# Altium schematic sheet PowerSupply.SchDoc
size A4; SheetNumber: 2; SheetTotal: 6
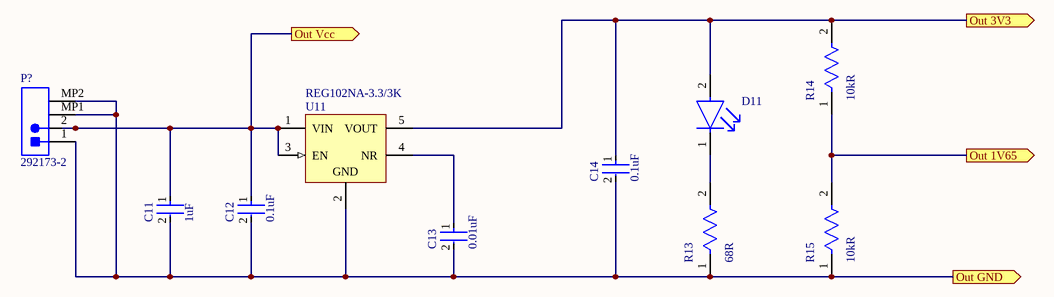
[diagram p0: PowerSupply.SchDoc]

## Parts
C11  Capacitance: 1uF  [FP-0603-L_1_6_0_15-W_0_81-IPC_A]  (hidden comment: 0603ZD105KAT2A)
C12  Capacitance: 0.1uF  [FP-0603-L_1_6_0_15-W_0_81-IPC_A]  (hidden comment: 0603ZD105KAT2A)
C13  Capacitance: 0.01uF  [FP-0603-L_1_6_0_15-W_0_81-IPC_A]  (hidden comment: 0603ZD105KAT2A)
C14  Capacitance: 0.1uF  [FP-0603-L_1_6_0_15-W_0_81-IPC_A]  (hidden comment: 0603ZD105KAT2A)
D11  TLMP1100-GS08  [FP-6_541-5056_01-4-MFG]  (value not drawn)
P?  292173-2  [TECO-292173-2_V]
R13  Resistance: 68R  [FP-CRCW0603-e3-IPC_B]  (hidden comment: CRCW060311K5FKEA)
R14  Resistance: 10kR  [FP-CRCW0603-e3-IPC_B]  (hidden comment: CRCW060311K5FKEA)
R15  Resistance: 10kR  [FP-CRCW0603-e3-IPC_B]  (hidden comment: CRCW060311K5FKEA)
U11  REG102NA-3.3/3K  [DBV0005A_N]

## Ports
Out 1V65 (out), Out 3V3 (out), Out GND (out), Out Vcc (out)

## Nets
Out 1V65: R14.1 R15.2 ; port Out 1V65
Out 3V3: C14.1 D11.2(A) R14.2 U11.5(VOUT) ; port Out 3V3
Out GND: C11.2 C12.2 C13.2 C14.2 P?.1 P?.MP1 P?.MP2 R13.1 R15.1 U11.2(GND) ; port Out GND
Out Vcc: C11.1 C12.1 P?.2 U11.1(VIN) U11.3(EN) ; port Out Vcc
NetC13_1: C13.1 U11.4(NR)
NetD11_1: D11.1(C) R13.2

## Library data of the parts
C11-C14 = CMP-2006-04559-3: General Purpose Ceramic Capacitor, 0603, 1uF, 10%, X5R, 15%, 10V; Insulation Resistance: 100GR; Dissipation Factor: 5%; Packaging: Tape and Reel; RoHS Compliant: Yes; Height: 0.9mm; Tolerance: 10%; Length: 1.6mm; Depth: 0.81mm; Case/Package: 0603; Max Operating Temperature: 85°C; Series: -; Dielectric: X5R; Construction: Flat; REACH SVHC: No SVHC; Voltage Rating: 10V; Number of Pins: 2; Radiation Hardening: No; Case Code (Imperial): 0603; Min Operating Temperature: -55°C; Termination: SMD/SMT; Contact Plating: Tin; Voltage: 10V; Thickness: 0.035inch; Lead Free: Lead Free; Mount: Surface Mount; Width: 0.81mm; Voltage Rating (DC): 10V; Package Quantity: 4000; Case Code (Metric): 1608
D11 = CMP-02520-000009-1: LED GREEN 0603 SMD; Manufacturer: Vishay; Max Junction Temp: +120°C; Automotive Grade: Grade 3; Reverse Voltage: 6V; Led Orientation: Top View; Forward Voltage: 2.1V; Luminous Intensity: 15mcd; Forward Current: 20mA; Colour: Pure green; Peak Emmision Wavelength: 562nm; Wavelength: 561nm; Viewing Angle: 160°; Power Dissipation: 90mW; Digikey Description: LED GREEN 0603 SMD; Package: 6.541-5056.01-4; Ambient Temperature Range High: +100°C; Height: 0.65mm; Device Class L1: Optoelectronics; Device Class L2: LEDs; Mouser Description: Standard LEDs - SMD Pure Green; Temperature Range High: +120°C; RoHS: TRUE; Ambient Temperature Range Low: -40°C; Temperature: to +120°C; Manufacturer Part Number: TLMP1100-GS08; ComponentLink2URL: http://www.vishay.com/docs/83173/tlmb1100.pdf; Lead Free: Yes; Octopart: https://octopart.com/tlmp1100-gs08-vishay-55433993; Automotive: Yes; Device Class L3: unset; ComponentLink2Description: Datasheet; Category: Diode
P? = CMP-2000-05552-1: Male Header, Pitch 2 mm, 1 x 2 Position, Height 5.8 mm, -40 to 105 degC, RoHS, Tape and Reel; Manufacturer: TE Connectivity; Number of Positions: 2; Other Names: A98624DKR; Pitch: 0.079"(2.00mm); Connector Type: Header,Shrouded; 3D Model: 292173-2.pdf; Dynamic Catalog: CommonTermination,CTSeries; Mating Products: 2-179694-2-ND / -CONNRCPT2POSIDCMT2MMSGL; Number of Positions Loaded: All; Package Reference: 292173-2; Mounting Technology: SurfaceMount; Termination: Solder; Datasheet Version: Rev. C3, 10/2011; Datasheet URL: http://www.te.com/commerce/DocumentDelivery/DDEController?Action=showdoc&DocId=Customer+Drawing%7F292173%7FC3%7Fpdf%7FEnglish%7FENG_CD_292173_C3.pdf%7F292173-2; Contact Mating Length: 0.165"(4.19mm); Series: CommonTermination,CT; Contact Type: MalePin; Packaging: Digi-Reel®; Contact Finish: Tin; Category: Connectors,Interconnects; Family: RectangularConnectors-Headers,MalePins; Color: Black; Package Description: Male Header, Pitch 2 mm, 1 x 2 Position, Height 5.8 mm; Number of Rows: 1; Manufacturer URL: http://www.te.com/; Mounting Type: SurfaceMount,RightAngle; RoHS Information: 292173-2StatementofCompliance; Features: BoardGuide,SolderRetention; Standard Package: 1
R13-R15 = CMP-2000-03864-2: RES Thick Film, 11.5kΩ, 1%, 0.1W, 100ppm/°C, 0603; Working Voltage: 75V; Power Rating: 100mW; Packaging: Tape and Reel; Temperature Coefficient: 100ppm/°C; Weight: 7.1E-05oz; Case Code (Imperial): 0603; Height: 0.45mm; Depth: 0.85mm; Case/Package: 0603; Width: 0.85mm; Radiation Hardening: No; Number of Terminations: 2; Lead Free: Lead Free; Min Operating Temperature: -55°C; Number of Pins: 2; Voltage Rating (DC): 75V; Military Standard: Not; Voltage Rating: 75V; Package Quantity: 10; Composition: Thick Film; Contact Plating: Tin; Max Power Dissipation: 100mW; Length: 1.55mm; Case Code (Metric): 1608; Features: Automotive AEC-Q200; Max Operating Temperature: 155°C; Tolerance: 1%; Termination: SMD/SMT
U11 = CMP-0394-00176-2: Single Output Fast Transient Response LDO, 250 mA, Fixed 3.3 V Output, 1.8 to 12 V Input, 5-pin SOT-23 (DBV), -55 to 125 degC, Green (RoHS & no Sb/Br); Manufacturer: Texas Instruments; Vin(Max)(V): 12; Accuracy(%): 1.5; Vin(Min)(V): 1.8; Vout Adj(Min)(V): 3.3; Iout(Max)(A): 0.25; Vdo(Typ)(mV): 150; SubFamily: Single Channel LDO; Iq(Typ)(mA): 0.4; DatasheetVersion: SBVS024F; PackageDescription: 5-Pin Plastic Small Outline, Body 1.60 Ãƒâ€” 2.90 mm, Pitch 0.95 mm; Code_JEDEC: MO-178; PackageReference: DBV0005A; PackageVersion: 4073253-4/K; Fixed Output Options(V): 3.3; Mounting Technology: Surface Mount; ComponentLink3Description: Package Specification; PartNumber: REG102NA-3.3/3K; ComponentLink2Description: Datasheet; Vout Adj(Max)(V): 3.3; ComponentLink1URL: http://www.ti.com/; ComponentLink3URL: http://www.ti.com/litv/pdf/mpds018i; Eco-Plan: Green (RoHS & no Sb/Br); ComponentLink1Description: Manufacturer URL; ComponentLink2URL: http://www.ti.com/general/docs/lit/getliterature.tsp?genericPartNumber=REG102-33&fileType=pdf